# EAGLE schematic FeerPong (EAGLE 8.4.2)
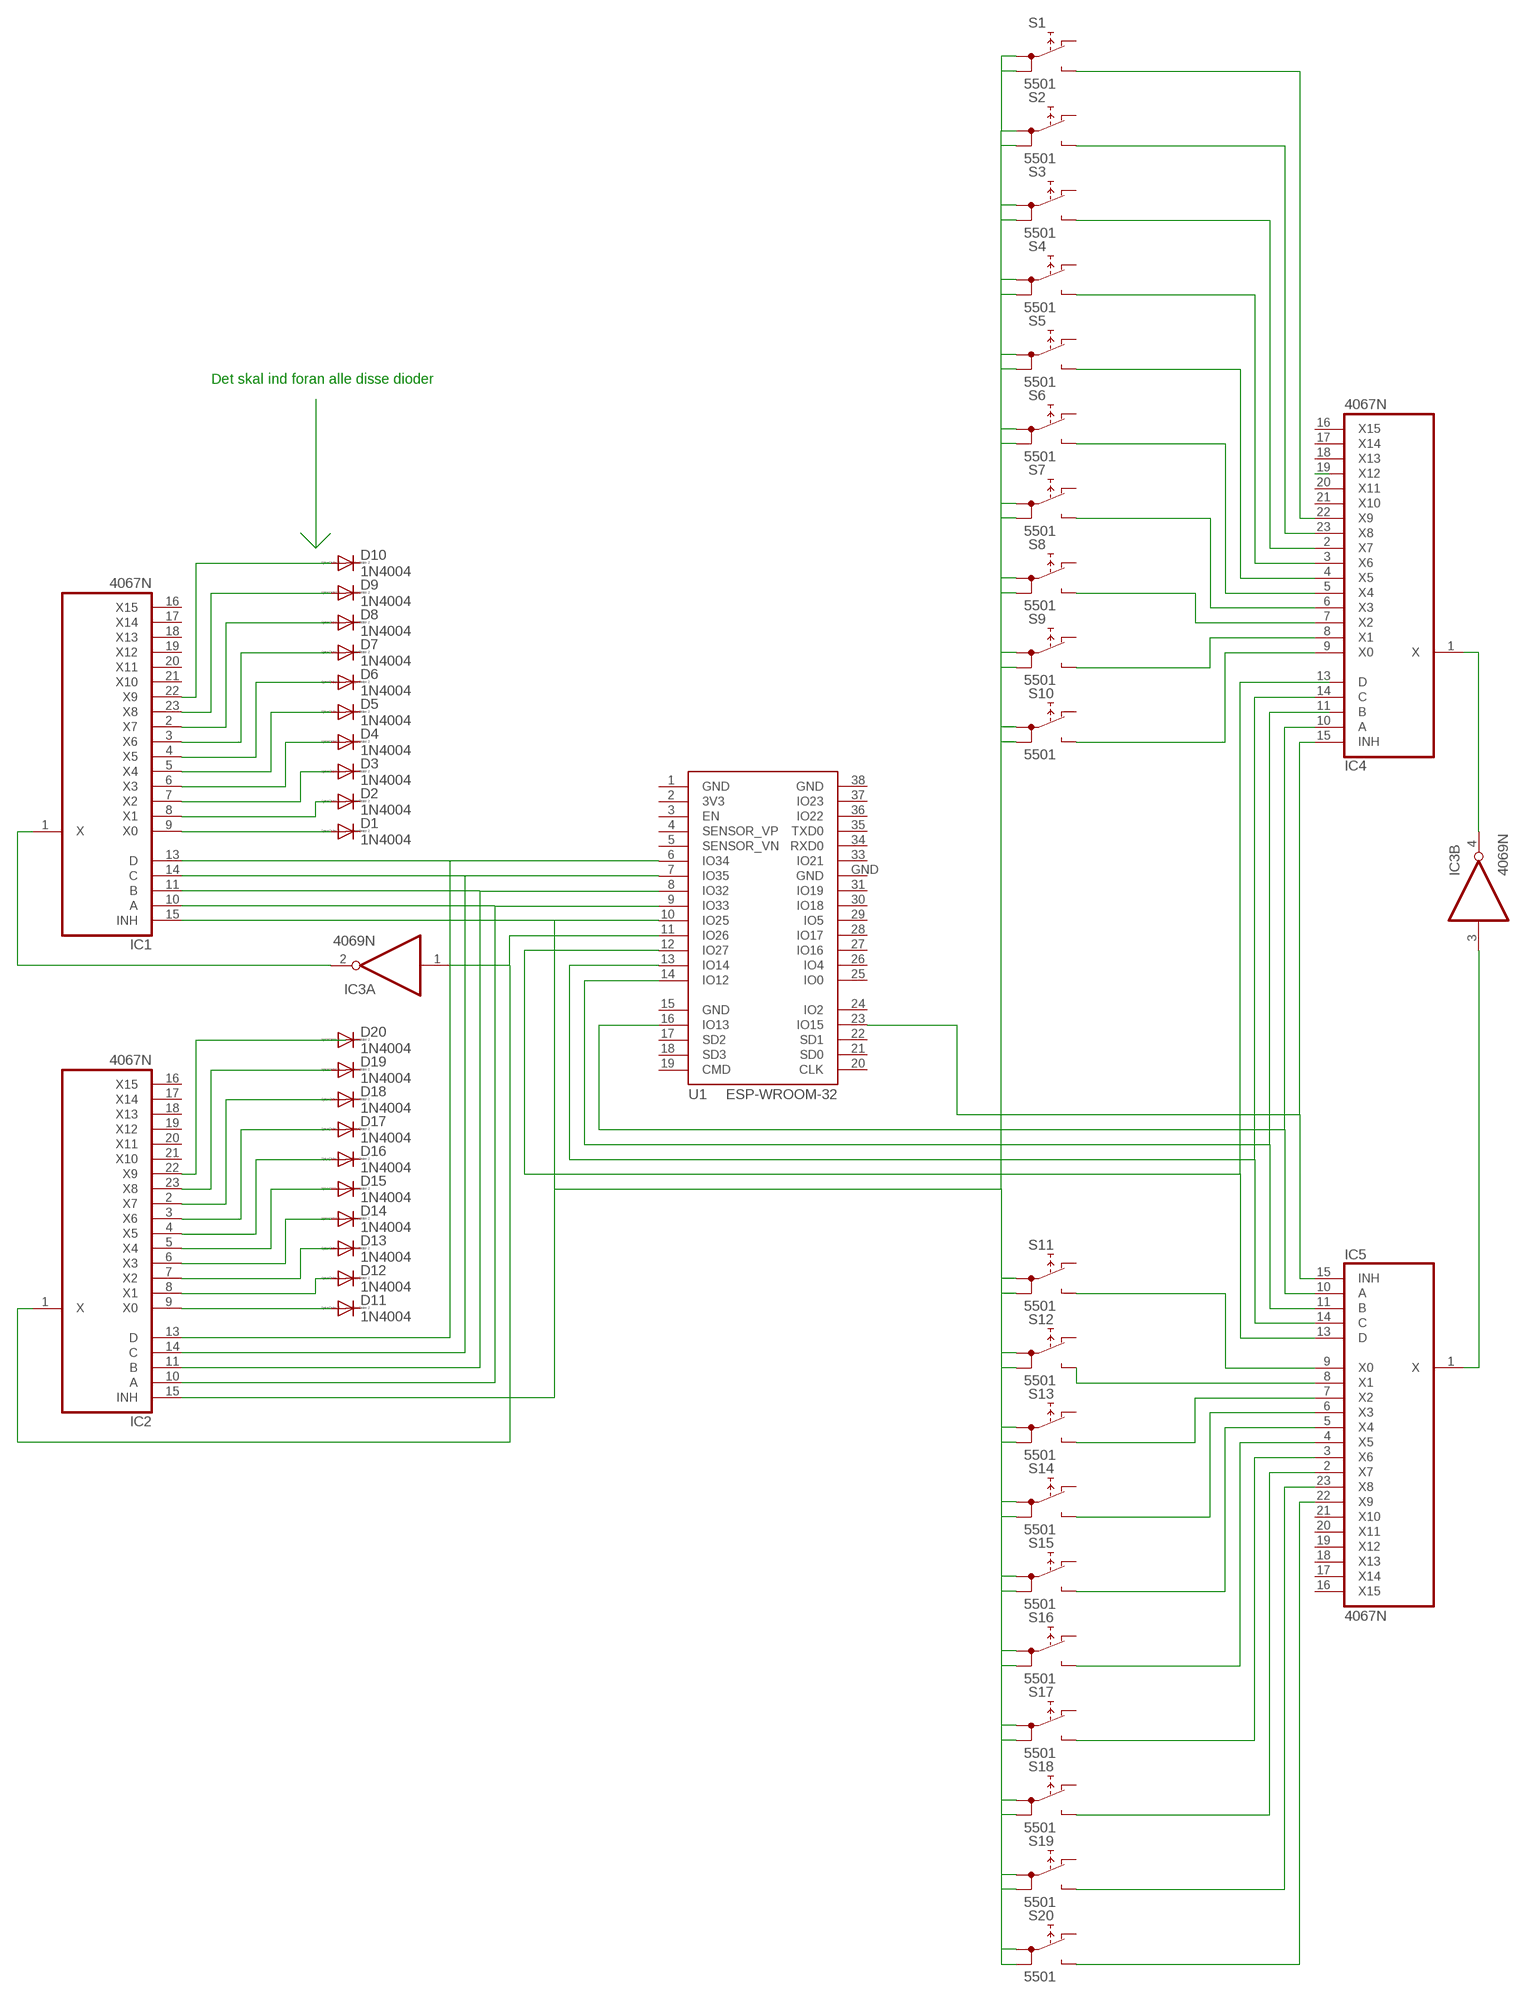
[diagram p0: schematic, sheet 1]

## Parts
D1  1N4004  [DO41-10]
D2  1N4004  [DO41-10]
D3  1N4004  [DO41-10]
D4  1N4004  [DO41-10]
D5  1N4004  [DO41-10]
D6  1N4004  [DO41-10]
D7  1N4004  [DO41-10]
D8  1N4004  [DO41-10]
D9  1N4004  [DO41-10]
D10  1N4004  [DO41-10]
D11  1N4004  [DO41-10]
D12  1N4004  [DO41-10]
D13  1N4004  [DO41-10]
D14  1N4004  [DO41-10]
D15  1N4004  [DO41-10]
D16  1N4004  [DO41-10]
D17  1N4004  [DO41-10]
D18  1N4004  [DO41-10]
D19  1N4004  [DO41-10]
D20  1N4004  [DO41-10]
IC1  4067N  [DIL24-6]
IC2  4067N  [DIL24-6]
IC3  4069N  [DIL14]
IC4  4067N  [DIL24-6]
IC5  4067N  [DIL24-6]
S1  5501  [5501]
S2  5501  [5501]
S3  5501  [5501]
S4  5501  [5501]
S5  5501  [5501]
S6  5501  [5501]
S7  5501  [5501]
S8  5501  [5501]
S9  5501  [5501]
S10  5501  [5501]
S11  5501  [5501]
S12  5501  [5501]
S13  5501  [5501]
S14  5501  [5501]
S15  5501  [5501]
S16  5501  [5501]
S17  5501  [5501]
S18  5501  [5501]
S19  5501  [5501]
S20  5501  [5501]
U1  ESP-WROOM-32  [ESP-WROOM-32]

## Nets
N$1: IC2.1(X) IC3.1(A:I) U1.11(IO26)
N$2: IC1.1(X) IC3.2(A:O)
N$3: IC1.10(A) IC2.10(A) U1.9(IO33)
N$4: IC1.11(B) IC2.11(B) U1.8(IO32)
N$5: IC1.14(C) IC2.14(C) U1.7(IO35)
N$6: IC1.13(D) IC2.13(D) U1.6(IO34)
N$7: D1.A IC1.9(X0)
N$8: D2.A IC1.8(X1)
N$9: D11.A IC2.9(X0)
N$10: D3.A IC1.7(X2)
N$11: D4.A IC1.6(X3)
N$12: D5.A IC1.5(X4)
N$13: D6.A IC1.4(X5)
N$14: D7.A IC1.3(X6)
N$15: D8.A IC1.2(X7)
N$16: D9.A IC1.23(X8)
N$17: D10.A IC1.22(X9)
N$18: D12.A IC2.8(X1)
N$19: D13.A IC2.7(X2)
N$20: D14.A IC2.6(X3)
N$21: D15.A IC2.5(X4)
N$22: D16.A IC2.4(X5)
N$23: D17.A IC2.3(X6)
N$24: D18.A IC2.2(X7)
N$25: D19.A IC2.23(X8)
N$26: IC2.22(X9)
N$27: IC4.10(A) IC5.10(A) U1.16(IO13)
N$28: IC5.11(B) U1.14(IO12)
N$29: IC4.14(C) IC5.14(C) U1.13(IO14)
N$30: IC5.13(D) U1.12(IO27)
N$31: IC4.9(X0) S10.NO
N$32: IC3.3(B:I) IC5.1(X)
N$33: IC5.9(X0) S11.NO
N$34: IC5.8(X1) S12.NO
N$35: IC5.22(X9) S20.NO
N$36: IC5.23(X8) S19.NO
N$37: IC5.2(X7) S18.NO
N$38: IC5.3(X6) S17.NO
N$39: IC5.4(X5) S16.NO
N$40: IC5.5(X4) S15.NO
N$41: IC5.6(X3) S14.NO
N$42: IC5.7(X2) S13.NO
N$43: IC4.19(X12)
N$44: IC4.8(X1) S9.NO
N$45: IC4.22(X9) S1.NO
N$46: IC4.15(INH) IC5.15(INH) U1.23(IO15)
N$47: IC4.23(X8) S2.NO
N$48: IC4.2(X7) S3.NO
N$49: IC4.3(X6) S4.NO
N$50: IC4.4(X5) S5.NO
N$51: IC4.5(X4) S6.NO
N$52: IC4.6(X3) S7.NO
N$53: IC4.7(X2) S8.NO
N$54: IC3.4(B:O) IC4.1(X)
N$55: IC1.15(INH) IC2.15(INH) S1.1A S1.1B S2.1A S2.1B S3.1A S3.1B S4.1A S4.1B S5.1A S5.1B S6.1A S6.1B S7.1A S7.1B S8.1A S8.1B S9.1A S9.1B S10.1A S10.1B S11.1A S11.1B S12.1A S12.1B S13.1A S13.1B S14.1A S14.1B S15.1A S15.1B S16.1A S16.1B S17.1A S17.1B S18.1A S18.1B S19.1A S19.1B S20.1A S20.1B U1.10(IO25)
Unconnected: D1.C D2.C D3.C D4.C D5.C D6.C D7.C D8.C D9.C D10.C D11.C D12.C D13.C D14.C D15.C D16.C D17.C D18.C D19.C D20.A D20.C IC1.16(X15) IC1.17(X14) IC1.18(X13) IC1.19(X12) IC1.20(X11) IC1.21(X10) IC2.16(X15) IC2.17(X14) IC2.18(X13) IC2.19(X12) IC2.20(X11) IC2.21(X10) IC3.5(C:I) IC3.6(C:O) IC3.8(D:O) IC3.9(D:I) IC3.10(E:O) IC3.11(E:I) IC3.12(F:O) IC3.13(F:I) IC4.11(B) IC4.13(D) IC4.16(X15) IC4.17(X14) IC4.18(X13) IC4.20(X11) IC4.21(X10) IC5.16(X15) IC5.17(X14) IC5.18(X13) IC5.19(X12) IC5.20(X11) IC5.21(X10) S1.NC S2.NC S3.NC S4.NC S5.NC S6.NC S7.NC S8.NC S9.NC S10.NC S11.NC S12.NC S13.NC S14.NC S15.NC S16.NC S17.NC S18.NC S19.NC S20.NC U1.3(EN) U1.4(SENSOR_VP) U1.5(SENSOR_VN) U1.17(SD2) U1.18(SD3) U1.19(CMD) U1.20(CLK) U1.21(SD0) U1.22(SD1) U1.24(IO2) U1.25(IO0) U1.26(IO4) U1.27(IO16) U1.28(IO17) U1.29(IO5) U1.30(IO18) U1.31(IO19) U1.33(IO21) U1.34(RXD0) U1.35(TXD0) U1.36(IO22) U1.37(IO23)

## Notes on the sheet
- Det skal ind foran alle disse dioder

## Power pins joined to a net without a drawn wire
3V3: U1.2(3V3)
GND: U1.1(GND) U1.15(GND) U1.38(GND) U1.GND
VDD: IC1.24(VDD) IC2.24(VDD) IC3.14(P:VDD) IC4.24(VDD) IC5.24(VDD)
VSS: IC1.12(VSS) IC2.12(VSS) IC3.7(P:VSS) IC4.12(VSS) IC5.12(VSS)

## Library data of the parts
D1-D10 = diode:1N4004: DIODE general purpose rectifier, 1 A; SPICEPREFIX: D
D11-D20 = diode:1N4004: DIODE general purpose rectifier, 1 A
IC1 IC2 IC4 IC5 = 40xx:4067: 16-channel ANALOG MULTIPLEXER
IC3 = 40xx:4069: Hex INVERTER
S1-S20 = switch:55?: PUSHBUTTON SERIES 5500 SWITCHES Source: www.e-switch.com .. 5500.pdf
U1 = esp32:ESP-WROOM-32: Espressif Systems ESP-WROOM-32